# Altium schematic sheet Sheet1.SchDoc
size A4; Organization: HTL Hollabrunn; Address1: Abteilung Elektronik; Address2: Anton Ehrenfried-Straße 10; Address3: 2020 Hollabrunn; SheetNumber: 1; SheetTotal: 1; SPICEModelCacheTMCDYABR: <root> / <DocumentId>TMCDYABR</DocumentId> / <CacheFrame Number="0"> / <Model Name="ua741" Kind="CKT"> / <Text>*==================================================== / *uA741 / *Sngl GenPurpose OpAmp pkg:DIP8 3,2,7,4,6. pkg:CAN8 3,2,7,4,6. / * Connections: / *             Non-Inverting Input / *             | Inverting Input / *             | | Positive Power Supply / *             | | | Negative Power Supply / *             | | | | Output / *             | | | | | / .SUBCKT UA741 1 2 3 4 5 / C1   11 12 4.664E-12 / C2    6  7 20E-12 / DC    5 53 DX / DE   54  5 DX / DLP  90 91 DX / DLN  92 90 DX / DP    4  3 DX / BGND 99  0 V=V(3)*.5 + V(4)*.5 / BB    7 99 I=I(VB)*10.61E6 - I(VC)*10E6 + I(VE)*10E6 + / +              I(VLP)*10E6 - I(VLN)*10E6 / GA    6  0 11 12 137.7E-6 / GCM   0  6 10 99 2.574E-9 / IEE  10  4 DC 10.16E-6 / HLIM 90  0 VLIM 1K / Q1   11  2 13 QX / Q2   12  1 14 QX / R2    6  9 100E3 / RC1   3 11 7.957E3 / RC2   3 12 7.957E3 / RE1  13 10 2.74E3 / RE2  14 10 2.74E3 / REE  10 99 19.69E6 / RO1   8  5 150 / RO2   7 99 150 / RP    3  4 18.11E3 / VB    9  0 DC 0 / VC    3 53 DC 2.6 / VE   54  4 DC 2.6 / VLIM  7  8 DC 0 / VLP  91  0 DC 25 / VLN   0 92 DC 25 / .MODEL DX D(IS=800E-18) / .MODEL QX NPN(IS=800E-18 BF=62.5) / .ENDS UA741</Text> / </Model> / <Model Name="cap" Kind="MDL"> / <Text>*Default semiconductor capacitor / .MODEL CAP C()</Text> / </Model> / </CacheFrame> / </root>
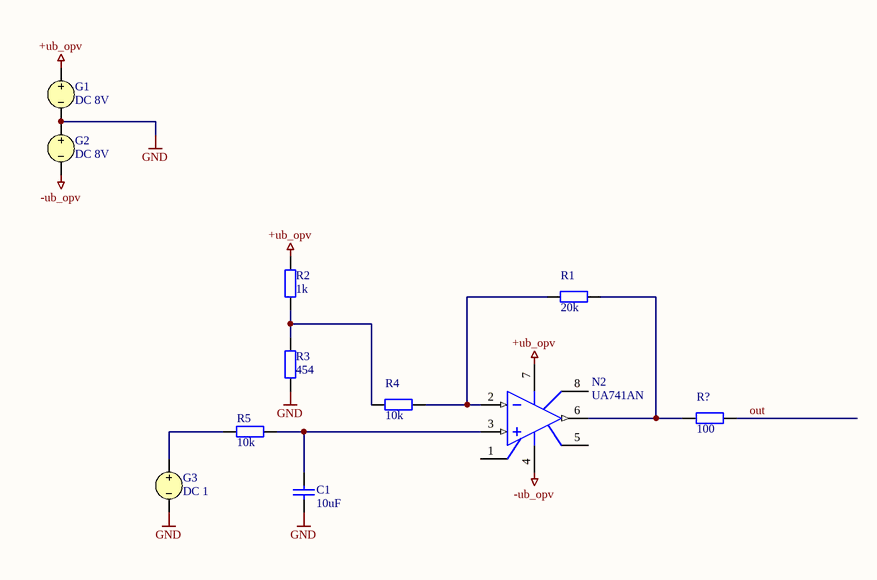
[diagram p0: Sheet1.SchDoc]

## Parts
C1  10uF  [C1206-KUE]
G1  DC 8V
G2  DC 8V
G3  DC 1
N2  UA741AN  [DIP8]
R1  20k  [C1206-KUE]
R2  1k  [C1206-KUE]
R3  454  [C1206-KUE]
R4  10k  [C1206-KUE]
R5  10k  [C1206-KUE]
R?  100  [C1206-KUE]

## Nets
+ub_opv: G1.1 N2.7(V+) R2.1
-ub_opv: G2.2 N2.4(V-)
GND: C1.1 G1.2 G2.1 G3.2 R3.2
out: R?.1
NetC1_2: C1.2 N2.3(IN+) R5.1
NetG3_1: G3.1 R5.2
NetN2_2: N2.2(IN-) R1.2 R4.1
NetN2_6: N2.6(OUT) R1.1 R?.2
NetR2_2: R2.2 R3.1 R4.2

Not connected (* = marked no-connect by the designer): N2 1(OS_NULL) 5(OS_NULL) 8(NC)

## Notes on the sheet
- Title
- Size:
- Date:
- A4
- Number:
- Time:
- Revision:
- Sheet
- of
- HTL Hollabrunn
- Abteilung Elektronik
- Anton Ehrenfried-Straße 10
- 2020 Hollabrunn
- File:
- Drawn By:

## Library data of the parts
C1 = Capacitor: Manufacturer: Kemet; Bezeichnung: Kerko +-10% 63V; Published: 8-Jun-2000; LatestRevisionDate: 17-Jul-2002; LatestRevisionNote: Re-released for DXP Platform.; PackageReference: RAD-0.3; Publisher: Altium Limited; PackageDescription: Radial Cap, Thru-Hole; 2 Leads; 0.3 in Pin Spacing; Value: 10uF; Orderingcode: *
G1 G2 = VSRC: Voltage Source; Note: PCB Footprint - Not required; Published: 8-Jun-2000; LatestRevisionDate: 17-Jul-2002; LatestRevisionNote: Re-released for DXP Platform.; PackageReference: Not Applicable; Publisher: Altium Limited; Value: 8V
G3 = VSRC: Voltage Source; Note: PCB Footprint - Not required; Value: 1; Published: 8-Jun-2000; LatestRevisionDate: 17-Jul-2002; LatestRevisionNote: Re-released for DXP Platform.; PackageReference: Not Applicable; Publisher: Altium Limited
N2 = UA741AN: General-Purpose Single Operational Amplifier; Published: 24-Aug-2001; LatestRevisionDate: 06-Jun-2005; LatestRevisionNote: Stylized 3D Model Added.; DatasheetVersion: Oct-1997; PackageReference: DIP8; Publisher: Altium Limited; PackageDescription: DIP; 8 Leads; Row Spacing 7.62 mm; Pitch 2.54 mm; Code_JEDEC: MO-001-AN; ComponentLink1Description: Manufacturer Link; ComponentLink1URL: http://www.st.com/; ComponentLink2Description: Datasheet; ComponentLink2URL: http://www.st.com/stonline/products/literature/ds/5304/ua741.pdf
R1-R5 R? = ResistorSMD: Resistor SMD; Manufacturer: AVX; Bezeichnung: SMD Wid. 1/8W 2%; Published: 8-Jun-2000; LatestRevisionDate: 17-Jul-2002; LatestRevisionNote: Re-released for DXP Platform.; PackageReference: AXIAL-0.4; Publisher: Altium Limited; PackageDescription: Axial Device, Thru-Hole; 2 Leads; 0.4 in Pin Spacing; Orderingcode: *
  R1: Value: 20k
  R2: Value: 1k
  R3: Value: 454
  R4 R5: Value: 10k
  R?: Value: 100